# Altium project PO_Soldeerstation.PrjPcb
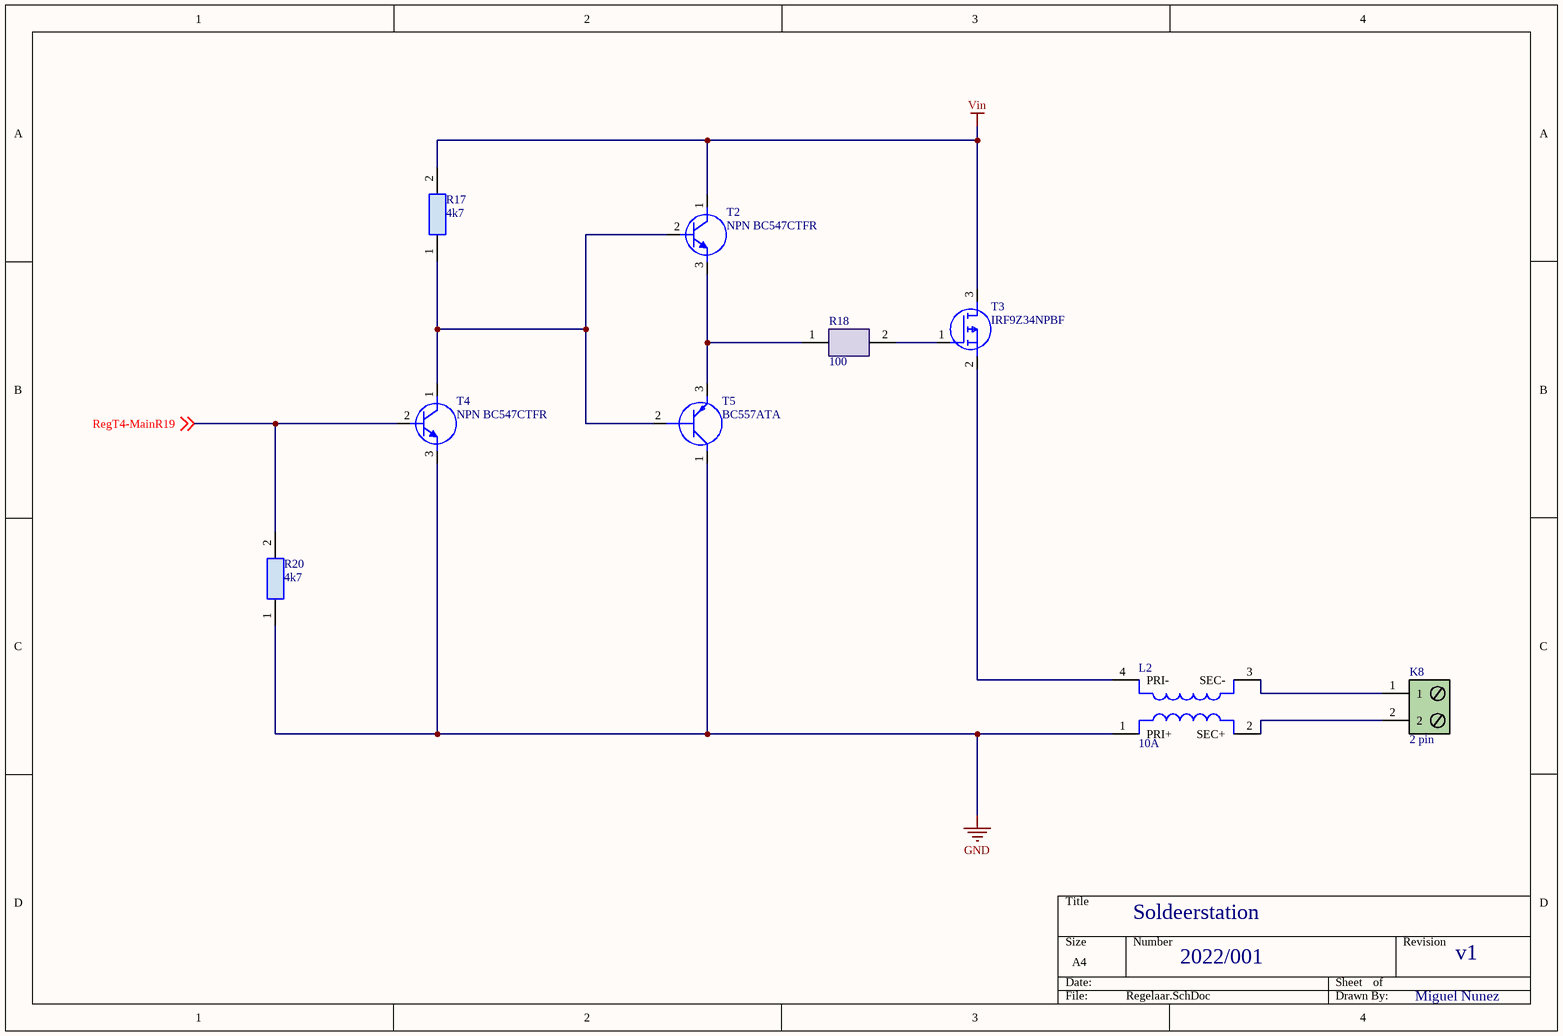
[diagram p0: Regelaar.SchDoc]
6 sheets, 87 parts. Net scope: global (net labels, ports and power ports of the same name join across sheets).
Board files: DisplayPrint.PcbDoc, NewPrintMainV3.PcbDoc, LedPrintV4.PcbDoc, MainSecEdition.PcbDoc, LedRond.PcbDoc
Sheets:
  Regelaar.SchDoc
  Display.SchDoc
  Versterker.SchDoc
  Voeding.SchDoc
  MainIC.SchDoc
  Led.SchDoc

## Sheet Regelaar.SchDoc: Soldeerstation
size A4; DrawnBy: Miguel Nunez; DocumentNumber: 2022/001; Revision: v1; SheetNumber: 1; SheetTotal: 6

### Parts
K8  2 pin  [1729128]
L2  10A  [CM2545X171B10]
R17  4k7  [CAPC2012X65N]
R18  100  [RESC1220X65N]
R20  4k7  [CAPC2012X65N]
T2  NPN BC547CTFR  [BC33740TA]
T3  IRF9Z34NPBF  [TO254P469X1042X1967-3P]
T4  NPN BC547CTFR  [BC33740TA]
T5  BC557ATA  [BC33740TA]

### Nets
GND: L2.1(PRI+) R20.1 T4.3(E) T5.1(C)
Vin: R17.2 T2.1(C) T3.3(D)
RegT4-MainR19: R20.2 T4.2(B) ; off-sheet RegT4-MainR19
NetK8_1: K8.1 L2.3(SEC-)
NetK8_2: K8.2 L2.2(SEC+)
NetL2_4: L2.4(PRI-) T3.2(S)
NetR17_1: R17.1 T2.2(B) T4.1(C) T5.2(B)
NetR18_1: R18.1 T2.3(E) T5.3(E)
NetR18_2: R18.2 T3.1(G)

### Library data of the parts
K8 = Term. blok 2 pin: Connector Term. blok. 1729128 2 pin; Manufacturer_Name: Phoenix Contact; Datasheet Link: http://www.phoenixcontact.com/de/produkte/1729128/pdf; Height: 10.15mm; Manufacturer_Part_Number: 1729128
L2 = CM2545X171B-10: common mode smoorspoel 10A; Manufacturer_Name: Laird Technologies; Datasheet Link: https://datasheet.datasheetarchive.com/originals/dk/DKDS-7/122753.pdf; Height: 9.5mm; Manufacturer_Part_Number: CM2545X171B-10
R17 R20 = RES 4k7 0805: 4k7 SMD 0805  ESR10EZPJ472; Manufacturer_Name: ROHM Semiconductor; Datasheet Link: https://componentsearchengine.com/Datasheets/2/ESR10EZPJ472.pdf; Height: 0.65mm; Manufacturer_Part_Number: ESR10EZPJ472
R18 = RES 100 0508: 100 Ohm SMD 0508  LTR10EZPJ101; Manufacturer_Name: ROHM Semiconductor; Datasheet Link: https://componentsearchengine.com//LTR10EZPJ101.pdf; Height: 0.65mm; Mouser2 Part Number: 755-LTR10EZPJ101; Mouser2 Price/Stock: https://www.mouser.com/Search/Refine.aspx?Keyword=755-LTR10EZPJ101; Manufacturer_Part_Number: LTR10EZPJ101
T2 T4 = TR BC547CTFR: Transistor BC547CTFR NPN; Mfr_Name: onsemi; Type: DEV; Copyright: Copyright (C) 2022 Ultra Librarian. All rights reserved.; Manufacturer_Part_Number: BC547CTFR; RefDes: RefDes
T3 = TR IRF9Z34NPBF: MOSFET (P-Channel); Manufacturer_Name: Infineon; Datasheet Link: https://componentsearchengine.com//IRF9Z34NPBF.pdf; Height: 4.69mm; Mouser2 Part Number: 942-IRF9Z34NPBF; Mouser2 Price/Stock: https://www.mouser.com/Search/Refine.aspx?Keyword=942-IRF9Z34NPBF; Manufacturer_Part_Number: IRF9Z34NPBF
T5 = TR BC557ATA: Transistor BJT BC557ATA PNP; Manufacturer_Name: ON Semiconductor; Datasheet Link: https://componentsearchengine.com//BC557ATA.pdf; Mouser2 Part Number: 512-BC557ATA; Mouser2 Price/Stock: https://www.mouser.com/Search/Refine.aspx?Keyword=512-BC557ATA; Manufacturer_Part_Number: BC557ATA

## Sheet Display.SchDoc: Soldeerstation
size A4; DrawnBy: Miguel Nunez; DocumentNumber: 2022/001; Revision: v1; SheetNumber: 2; SheetTotal: 6
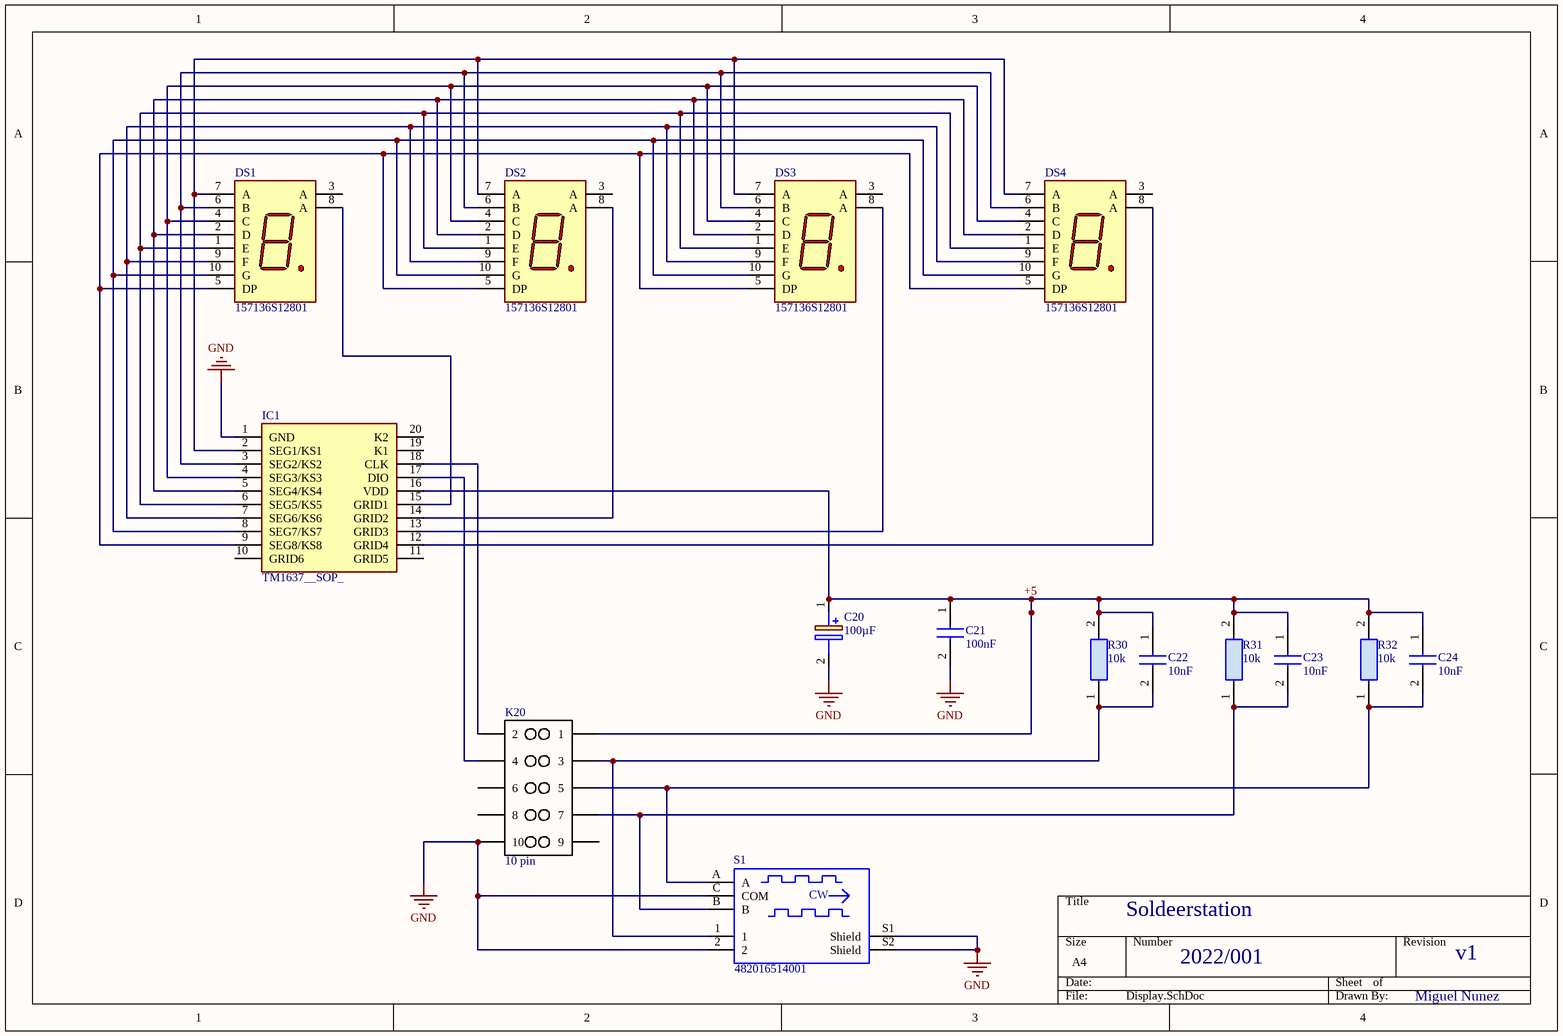
[diagram p1: Display.SchDoc]

### Parts
C20  100µF  [WCAP-AT1H_D10H16]
C21  100nF  [WCAP-CSGP_0805_L2W1.25H0.8_Reflow]
C22  10nF  [CAPC2012X100N]
C23  10nF  [CAPC2012X100N]
C24  10nF  [CAPC2012X100N]
DS1  157136S12801  [WL-T7DS_L17.5W12.4H7]
DS2  157136S12801  [WL-T7DS_L17.5W12.4H7]
DS3  157136S12801  [WL-T7DS_L17.5W12.4H7]
DS4  157136S12801  [WL-T7DS_L17.5W12.4H7]
IC1  TM1637__SOP_  [SOIC127P1045X280-20N]
K20  10 pin  [215307-5_TYC]
R30  10k  [RESC2012X60N]
R31  10k  [RESC2012X60N]
R32  10k  [RESC2012X60N]
S1  482016514001  [4820xx514001]

### Nets
+5: C20.1(+) C21.1 C22.1 C23.1 C24.1 IC1.16(VDD) K20.1 R30.2 R31.2 R32.2
GND: C20.2(-) C21.2 IC1.1(GND) K20.10 S1.2 S1.C(COM) S1.S1(Shield) S1.S2(Shield)
NetC22_2: C22.2 K20.3 R30.1 S1.1
NetC23_2: C23.2 K20.7 R31.1 S1.B
NetC24_2: C24.2 K20.5 R32.1 S1.A
NetDS1_1: DS1.1(E) DS2.1(E) DS3.1(E) DS4.1(E) IC1.6(SEG5/KS5)
NetDS1_2: DS1.2(D) DS2.2(D) DS3.2(D) DS4.2(D) IC1.5(SEG4/KS4)
NetDS1_4: DS1.4(C) DS2.4(C) DS3.4(C) DS4.4(C) IC1.4(SEG3/KS3)
NetDS1_5: DS1.5(DP) DS2.5(DP) DS3.5(DP) DS4.5(DP) IC1.9(SEG8/KS8)
NetDS1_6: DS1.6(B) DS2.6(B) DS3.6(B) DS4.6(B) IC1.3(SEG2/KS2)
NetDS1_7: DS1.7(A) DS2.7(A) DS3.7(A) DS4.7(A) IC1.2(SEG1/KS1)
NetDS1_8: DS1.8(A) IC1.15(GRID1)
NetDS1_9: DS1.9(F) DS2.9(F) DS3.9(F) DS4.9(F) IC1.7(SEG6/KS6)
NetDS1_10: DS1.10(G) DS2.10(G) DS3.10(G) DS4.10(G) IC1.8(SEG7/KS7)
NetDS2_8: DS2.8(A) IC1.14(GRID2)
NetDS3_8: DS3.8(A) IC1.13(GRID3)
NetDS4_8: DS4.8(A) IC1.12(GRID4)
NetIC1_17: IC1.17(DIO) K20.4
NetIC1_18: IC1.18(CLK) K20.2

Not connected (* = marked no-connect by the designer): DS1 3(A); DS2 3(A); DS3 3(A); DS4 3(A); IC1 10(GRID6) 11(GRID5) 19(K1) 20(K2); K20 6 8 9

### Notes on the sheet
- (in symbol 482016514001) CW

### Library data of the parts
C20 = ELCAP 100µF: Capacitor Polarised 100µF Wurth 860241181006; Manufacturer_Name: Wurth Elektronik; Datasheet Link: https://www.we-online.de/katalog/datasheet/860241181006.pdf; Height: 27mm; Manufacturer_Part_Number: 860241181006
C21 = CAP 0.1µF (100nF): Capacitor C0805C104K8RACAUTO; Manufacturer_Name: Kemet; Datasheet Link: https://ad.componentsearchengine.com/Datasheets/2/C0805C104K8RACAUTO.pdf; Height: 0.88mm; Manufacturer_Part_Number: C0805C104K8RACAUTO
C22-C24 = CAP 0.01µF (10nF): Capacitor C0805C103K1HACAUTO; Manufacturer_Name: Kemet; Datasheet Link: https://componentsearchengine.com//C0805C103K1HACAUTO.pdf; Height: 1mm; Mouser2 Part Number: 80-C0805C103K1HAUTO; Mouser2 Price/Stock: https://www.mouser.com/Search/Refine.aspx?Keyword=80-C0805C103K1HAUTO; Manufacturer_Part_Number: C0805C103K1HACAUTO
DS1-DS4 = 157136S12801: WL-T7DS 7 Segments Display THT Single Digit, Common Anode, 0.52" / 13.2mm, 38mcd, 2V, Super Red; Manufacturer: Wurth Elektronik; Circuitry: Common Anode; Width: 12.4mm; Mounting Technology: THT; Display Height: 0.52" / 13.2mm; Operating Temperature max.: 85C; Packaging: Tube; Luminous Intensity: 38mcd; Length: 17.5mm; ComponentLink2Description: Datasheet; Forward Voltage: 2V; ComponentLink1Description: Manufacturer Link; Manufacturer Part Number: 157136S12801; Height: 7mm; ComponentLink1URL: http://www.we-online.de; Emitting Color: Super Red; ComponentLink2URL: https://www.we-online.com/catalog/datasheet/157136S12801.pdf; Operating Temperature min.: -40C
IC1 = TM1637__SOP_: Integrated Circuit; Manufacturer_Name: TITAN MICRO ELECTRONICS; Manufacturer_Part_Number: TM1637 (SOP); Datasheet Link: https://www.mcielectronics.cl/website_MCI/static/documents/Datasheet_TM1637.pdf; Height: 2.8mm
K20 = Header 2x5: Header, 5-Pin, Dual row; LatestRevisionDate: 17-Jul-2002; LatestRevisionNote: Re-released for DXP Platform.; Publisher: Altium Limited
R30-R32 = RES 10k 0805: 10k SMD 0805  CR0805-FX-1002ELF; Manufacturer_Name: Bourns; Datasheet Link: https://componentsearchengine.com//CR0805-FX-1002ELF.pdf; Height: 0.6mm; Mouser2 Part Number: 652-CR0805FX-1002ELF; Mouser2 Price/Stock: https://www.mouser.com/Search/Refine.aspx?Keyword=652-CR0805FX-1002ELF; Manufacturer_Part_Number: CR0805-FX-1002ELF
S1 = 482016514001: WS-ENTV Mechanical Incremental Encoder Switch, Metal Shaft with bushing, 15Pulse/360deg, 30positions, 10mA; Manufacturer: Wurth Elektronik; Electrical Life Switch: 20000Cycles; Electrical Life Encoder: 15000Cycles; Insulation Resistance: 100MOhm; Operation Force: 600g; ComponentLink1Description: Manufacturer; ComponentLink1URL: http://www.we-online.de; ComponentLink2Description: Datasheet; ComponentLink2URL: https://www.we-online.com/catalog/datasheet/482016514001.pdf; Mounting Technology: THT; Manufacturer Part Number: 482016514001; Published Date: May 2021; Detent: 30positions; Operating Temperature: -40 to +85degC; Packaging: Tray; Resolution: 15Pulse/360deg; Rated Current: 10mA; Size: L13.75W11.7H26.6

## Sheet Versterker.SchDoc: Soldeerstation
size A4; DrawnBy: Miguel Nunez; DocumentNumber: 2022/001; Revision: v1; SheetNumber: 3; SheetTotal: 6
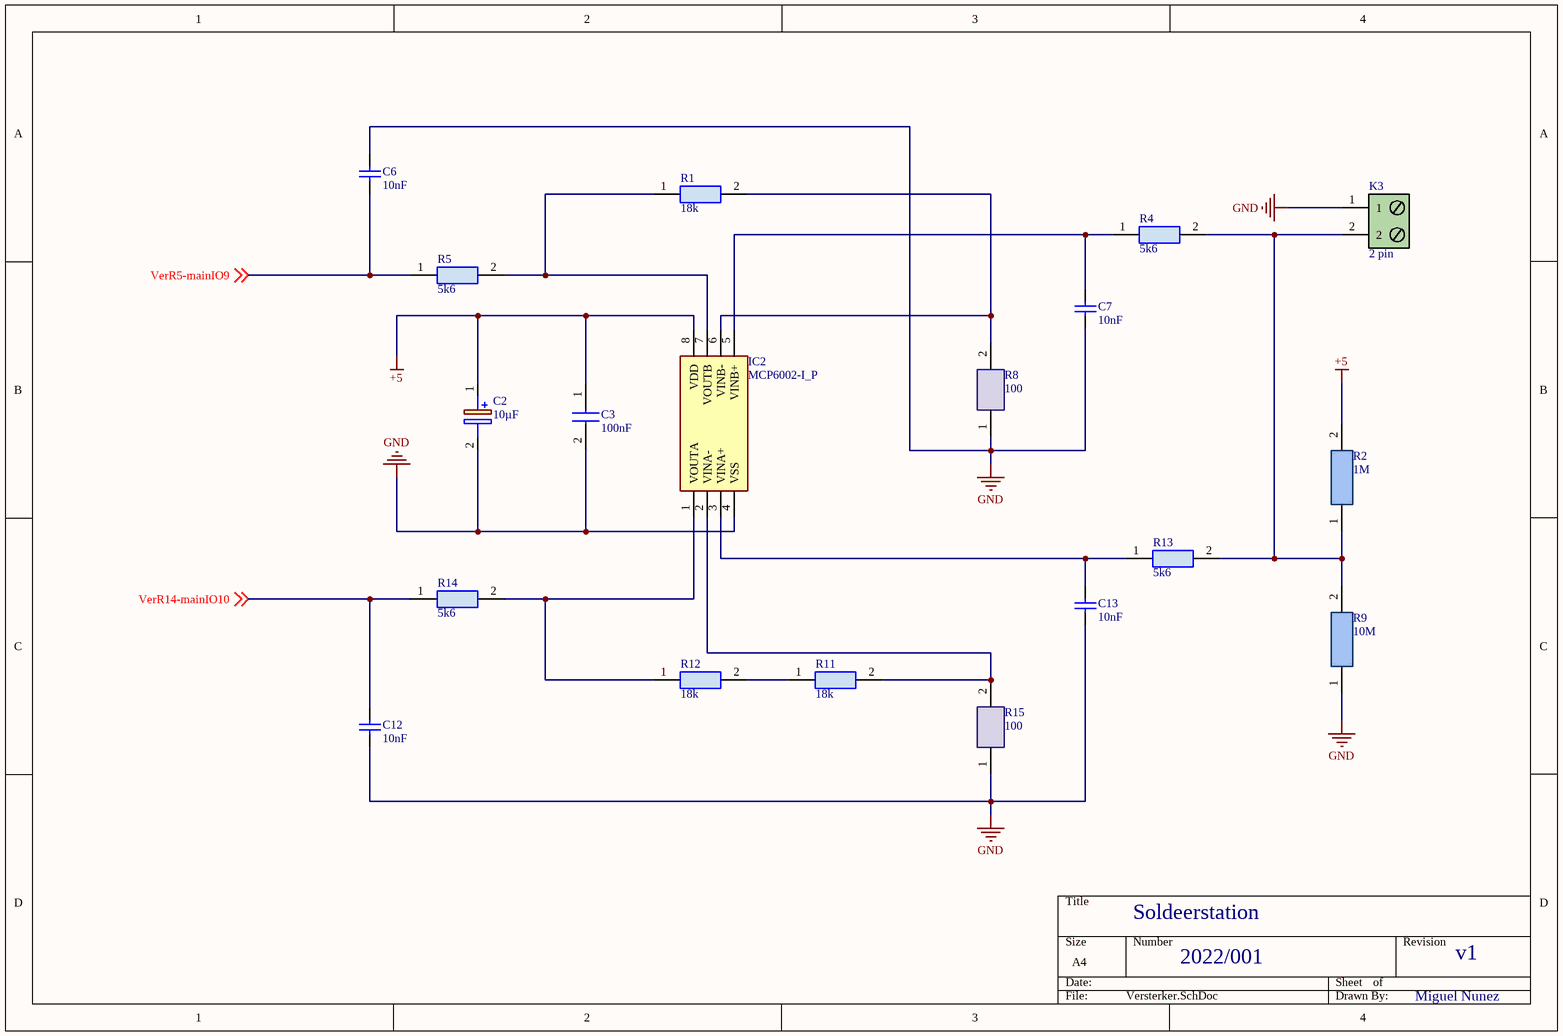
[diagram p2: Versterker.SchDoc]

### Parts
C2  10µF  [WCAP-AT1H_D5H11]
C3  100nF  [WCAP-CSGP_0805_L2W1.25H0.8_Reflow]
C6  10nF  [WCAP-CSGP_0805_L2W1.25H0.8_Reflow]
C7  10nF  [WCAP-CSGP_0805_L2W1.25H0.8_Reflow]
C12  10nF  [WCAP-CSGP_0805_L2W1.25H0.8_Reflow]
C13  10nF  [WCAP-CSGP_0805_L2W1.25H0.8_Reflow]
IC2  MCP6002-I_P  [DIP781W56P254L950H533Q8N]
K3  2 pin  [1729128]
R1  18k  [RESC2012X60N]
R2  1M  [RESC3115X65N]
R4  5k6  [RESC2012X50N]
R5  5k6  [RESC2012X50N]
R8  100  [RESC1220X65N]
R9  10M  [RESC3115X65N]
R11  18k  [RESC2012X60N]
R12  18k  [RESC2012X60N]
R13  5k6  [RESC2012X50N]
R14  5k6  [RESC2012X50N]
R15  100  [RESC1220X65N]

### Nets
+5: C2.1(+) C3.1 IC2.8(VDD) R2.2
GND: C2.2(-) C3.2 C6.2 C7.1 C12.1 C13.1 IC2.4(VSS) K3.1 R8.1 R9.1 R15.1
VerR5-mainIO9: C6.1 R5.1 ; off-sheet VerR5-mainIO9
VerR14-mainIO10: C12.2 R14.1 ; off-sheet VerR14-mainIO10
NetC7_2: C7.2 IC2.5(VINB+) R4.1
NetC13_2: C13.2 IC2.3(VINA+) R13.1
NetIC2_1: IC2.1(VOUTA) R12.1 R14.2
NetIC2_2: IC2.2(VINA-) R11.2 R15.2
NetIC2_6: IC2.6(VINB-) R1.2 R8.2
NetIC2_7: IC2.7(VOUTB) R1.1 R5.2
NetK3_2: K3.2 R2.1 R4.2 R9.2 R13.2
NetR11_1: R11.1 R12.2

### Library data of the parts
C2 = ELCAP 10µF: Capacitor Polarised Wurth Elektronik 860240672002 10µF; Datasheet Link: https://katalog.we-online.de/pbs/datasheet/860240672002.pdf; Height: 12.5mm; Manufacturer_Name: Wurth Elektronik; Manufacturer_Part_Number: 860240672002
C3 = CAP 0.1µF (100nF): as C21 on sheet Display; Datasheet Link: https://ad.componentsearchengine.com/Datasheets/2/C0805C104K8RACAUTO.pdf; Height: 0.88mm; Manufacturer_Part_Number: C0805C104K8RACAUTO
C6 C7 C12 C13 = CAP 0.01µF WE: WCAP-CSGP Multilayer Ceramic Chip Capacitor, General Purpose, size 0805, X7R, 10nF, 50V  885012207092; Manufacturer: Wurth Elektronik; Capacitance Tolerance: +/-10%; Dissipation Factor: 2.5%; Isolation Resistance: 10GOhm; Technical Reference: X7R0805103K050DFCT10000; Capacitance: 10nF; Ceramic Type: X7R; ComponentLink1Description: Manufacturer Link; ComponentLink1URL: http://www.we-online.de; ComponentLink2Description: Datasheet; ComponentLink2URL: https://www.we-online.com/catalog/datasheet/885012207092.pdf; Height: 0.8mm; Length: 2mm; Manufacturer Part Number: 885012207092; Mounting Technology: SMT; Operating Temperature max.: 125C; Operating Temperature min.: -55C; Packaging: Tape and Reel; Rated Voltage: 50V; Size: 0805; Width: 1.25mm
IC2 = MCP6002-I_P: Integrated Circuit Dual OPAMP MCP6002-I/P; Manufacturer_Name: Microchip; Datasheet Link: https://componentsearchengine.com//MCP6002-I_P.pdf; Height: 5.334mm; Mouser2 Part Number: 579-MCP6002-I/P; Mouser2 Price/Stock: https://www.mouser.com/Search/Refine.aspx?Keyword=579-MCP6002-I%2FP; Manufacturer_Part_Number: MCP6002-I/P
K3 = Term. blok 2 pin: as K8 on sheet Regelaar; Datasheet Link: http://www.phoenixcontact.com/de/produkte/1729128/pdf; Height: 10.15mm; Manufacturer_Part_Number: 1729128
R1 R11 R12 = RES 18k 0805: 18kΩ ±0.5% 0.1W 1/10W Chip Resistor 0805 (2012 Metric) Thin Film  RR1220P-183-D; Voltage Rating: 100V; Temperature Coefficient: 25ppm/°C; Power Rating: 100mW; Resistance: 18kR; Length: 2mm; Lead Free: Lead Free; Height: 0.4mm; Depth: 1.25mm; Packaging: Tape and Reel; Min Operating Temperature: -55°C; Case Code (Metric): 2012; Termination: SMD/SMT; Voltage Rating (DC): 100V; Case/Package: 0805; Max Operating Temperature: 125°C; RoHS Compliant: Yes; Mount: Surface Mount; Case Code (Imperial): 0805; Technology: THIN FILM; Tolerance: 0.5%; Number of Terminations: 2; Max Power Dissipation: 100mW; Series: RR; Size Code: 0805
R2 = RES 1M 1206: Res Thin Film 1206 1M0Ω 0.1% 0.25W 15ppm/°C Molded SMD; Manufacturer: TE Connectivity; Manufacturer Part Number: RP73D2B1M0BTDF; Voltage Rating: 200V; Temperature: -55°C to 155°C; Device Class L2: Resistors; Resistance: 1M0Ω; octopart_url: https://octopart.com/rp73d2b1m0btdf-te+connectivity-22741454; Power Rating: 0.25W; Temperature Range High: 155°C; ComponentLink2Description: Datasheet; Category: Res; Octopart: https://octopart.com/rp73d2b1m0btdf-te+connectivity-22741454; ComponentLink2URL: https://www.te.com/commerce/DocumentDelivery/DDEController?Action=showdoc&DocId=Data+Sheet%7F1773272%7FL%7Fpdf%7FEnglish%7FENG_DS_1773272_L.pdf%7F8-1879255-6; Package: RP732B; packaging: 1000 Reel; Ipc Land Pattern Name: RESC305155X55; Tolerance: 0.1%; Device Class L1: Passive Components; Series: RP73; Height: 0.65mm; Lead Free: Yes; Value: 1M0Ω; Device Class L3: Chip SMD Resistors; Temperature Coefficient: 15ppm/°C; Automotive: No; Composition: Thin Film; Temperature Range Low: -55°C; RoHS: TRUE
R4 R5 R13 R14 = RES 5k6 0805: 5k6 SMD 0805  CRCW08055K60JNEA; Manufacturer_Name: Vishay; Datasheet Link: http://www.vishay.com/docs/20035/dcrcwe3.pdf; Height: 0.5mm; Manufacturer_Part_Number: CRCW08055K60JNEA
R8 R15 = RES 100 0508: as R18 on sheet Regelaar; Datasheet Link: https://componentsearchengine.com//LTR10EZPJ101.pdf; Height: 0.65mm; Mouser2 Part Number: 755-LTR10EZPJ101; Mouser2 Price/Stock: https://www.mouser.com/Search/Refine.aspx?Keyword=755-LTR10EZPJ101; Manufacturer_Part_Number: LTR10EZPJ101
R9 = RES 10M 1206: Res Thin Film 1206 1M0Ω 0.1% 0.25W 15ppm/°C Molded SMD  1206 10M 5% 0.25W TCR200; Manufacturer: TE Connectivity; Manufacturer Part Number: RP73D2B1M0BTDF; Voltage Rating: 200V; Temperature: -55°C to 155°C; Device Class L2: Resistors; Resistance: 1M0Ω; octopart_url: https://octopart.com/rp73d2b1m0btdf-te+connectivity-22741454; Power Rating: 0.25W; Temperature Range High: 155°C; ComponentLink2Description: Datasheet; Category: Res; Octopart: https://octopart.com/rp73d2b1m0btdf-te+connectivity-22741454; ComponentLink2URL: https://www.te.com/commerce/DocumentDelivery/DDEController?Action=showdoc&DocId=Data+Sheet%7F1773272%7FL%7Fpdf%7FEnglish%7FENG_DS_1773272_L.pdf%7F8-1879255-6; Package: RP732B; packaging: 1000 Reel; Ipc Land Pattern Name: RESC305155X55; Tolerance: 0.1%; Device Class L1: Passive Components; Series: RP73; Height: 0.65mm; Lead Free: Yes; Value: 1M0Ω; Device Class L3: Chip SMD Resistors; Temperature Coefficient: 15ppm/°C; Automotive: No; Composition: Thin Film; Temperature Range Low: -55°C; RoHS: TRUE

## Sheet Voeding.SchDoc: Soldeerstation
size A4; DrawnBy: Miguel Nunez; DocumentNumber: 2022/001; Revision: v1; SheetNumber: 4; SheetTotal: 6
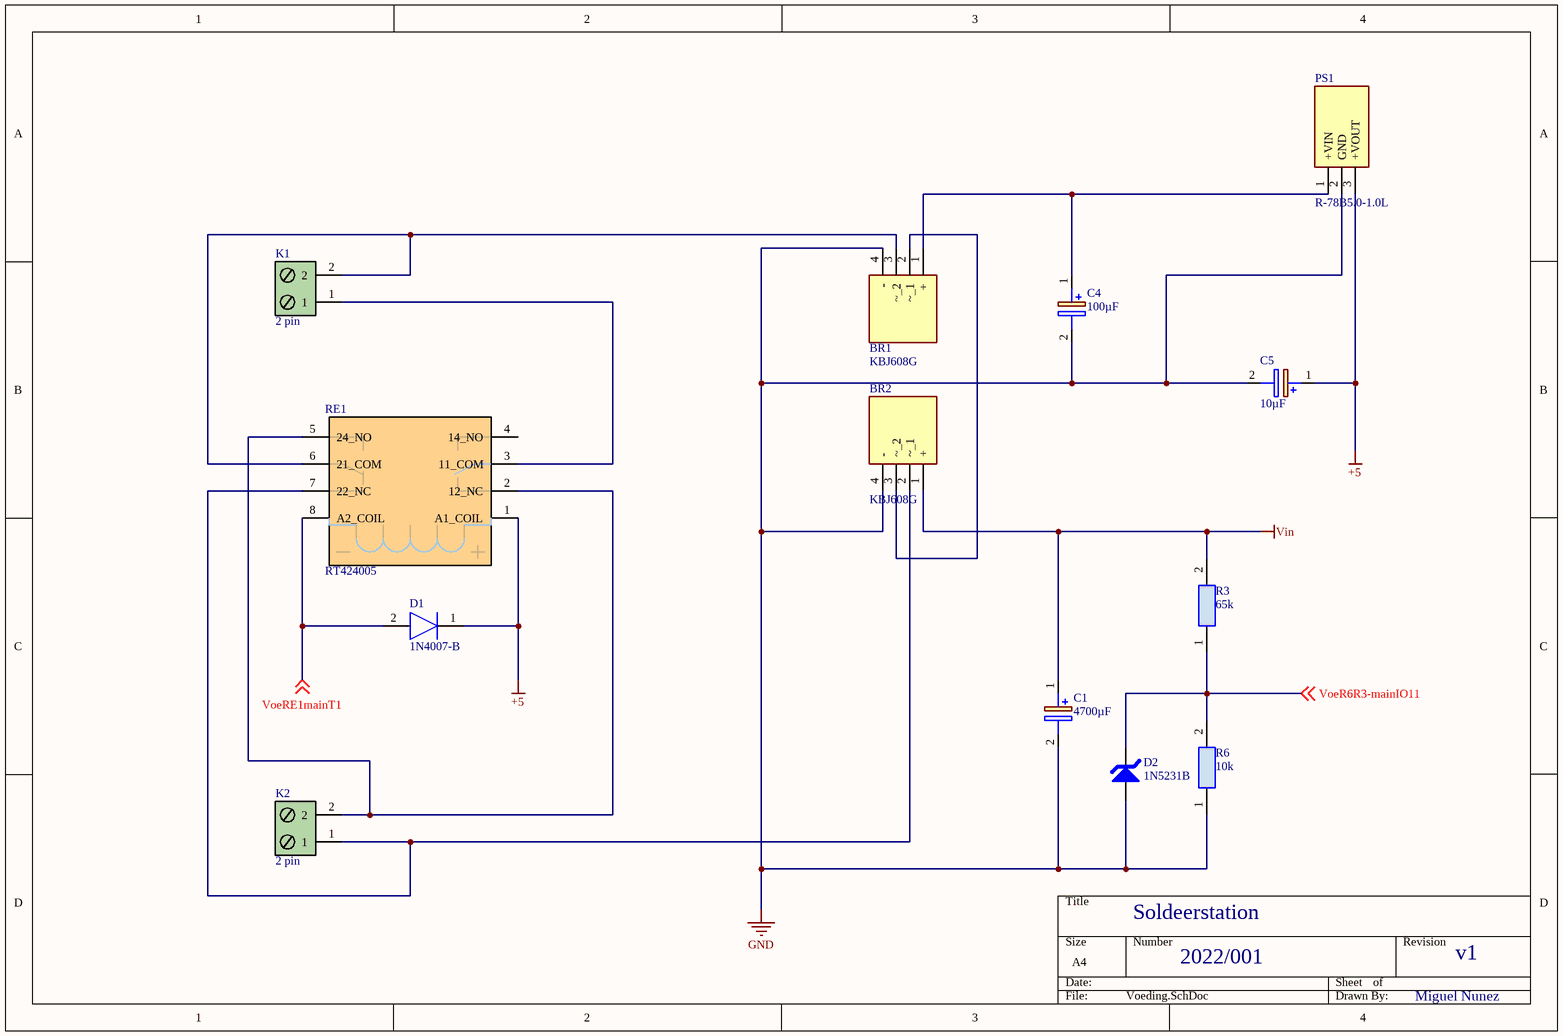
[diagram p3: Voeding.SchDoc]

### Parts
BR1  KBJ608G  [TO750P480X2500X1900-4P]
BR2  KBJ608G  [TO750P480X2500X1900-4P]
C1  4700µF  [WCAP-ATG8_D22H41]
C4  100µF  [WCAP-AT1H_D10H16]
C5  10µF  [WCAP-AT1H_D5H11]
D1  1N4007-B  [DIOAD1410W90L470D235]
D2  1N5231B  [DIOAD1165W56L425D185]
K1  2 pin  [1729128]
K2  2 pin  [1729128]
PS1  R-78B5.0-1.0L  [R78B1210L]
R3  65k  [RESC2012X60N]
R6  10k  [RESC2012X60N]
RE1  RT424005  [RT42]

### Nets
+5: C5.1(+) D1.1(K) PS1.3(+VOUT) RE1.1(A1_COIL)
GND: BR1.4(-) BR2.4(-) C1.2(-) C4.2(-) C5.2(-) D2.2 PS1.2(GND) R6.1
Vin: BR2.1(+) C1.1(+) R3.2
VoeR6R3-mainIO11: D2.1 R3.1 R6.2 ; off-sheet VoeR6R3-mainIO11
VoeRE1mainT1: D1.2(A) RE1.8(A2_COIL) ; off-sheet VoeRE1mainT1
NetBR1_1: BR1.1(+) C4.1(+) PS1.1(+VIN)
NetBR1_2: BR1.2(~_1) BR2.3(~_2)
NetBR1_3: BR1.3(~_2) K1.2 RE1.6(21_COM)
NetBR2_2: BR2.2(~_1) K2.1 RE1.7(22_NC)
NetK1_1: K1.1 RE1.3(11_COM)
NetK2_2: K2.2 RE1.2(12_NC) RE1.5(24_NO)

Not connected (* = marked no-connect by the designer): RE1 4(14_NO)

### Library data of the parts
BR1 BR2 = KBJ608G: Bridge Rectifier; Manufacturer_Name: Diodes Inc.; Datasheet Link: https://componentsearchengine.com//KBJ608G.pdf; Height: 4.8mm; Mouser2 Part Number: 621-KBJ608G; Mouser2 Price/Stock: https://www.mouser.com/Search/Refine.aspx?Keyword=621-KBJ608G; Manufacturer_Part_Number: KBJ608G
C1 = ELCAP 4700µF: Capacitor Polarised ESK478M050AQ3AA; Manufacturer_Name: Kemet; Datasheet Link: https://componentsearchengine.com//ESK478M050AQ3AA.pdf; Height: 37mm; Mouser2 Part Number: 80-ESK478M050AQ3AA; Mouser2 Price/Stock: https://www.mouser.com/Search/Refine.aspx?Keyword=80-ESK478M050AQ3AA; Manufacturer_Part_Number: ESK478M050AQ3AA
C4 = ELCAP 100µF: as C20 on sheet Display; Datasheet Link: https://www.we-online.de/katalog/datasheet/860241181006.pdf; Height: 27mm; Manufacturer_Part_Number: 860241181006
C5 = ELCAP 10µF: as C2 on sheet Versterker; Datasheet Link: https://katalog.we-online.de/pbs/datasheet/860240672002.pdf; Height: 12.5mm; Manufacturer_Name: Wurth Elektronik; Manufacturer_Part_Number: 860240672002
D1 = D 1N4007-B: Diode 1N4007-B 1000V, 1A; Manufacturer_Name: Rectron; Datasheet Link: https://www.arrow.com/en/products/1n4007-b/rectron; Manufacturer_Part_Number: 1N4007-B
D2 = ZD 1N5231B: Zenerdiode 1N5231B 5.1V 500mW; Mfr_Name: onsemi; Type: DEV; Copyright: Copyright (C) 2022 Ultra Librarian. All rights reserved.; Manufacturer_Part_Number: 1N5231B; RefDes: RefDes
K1 K2 = Term. blok 2 pin: as K8 on sheet Regelaar; Datasheet Link: http://www.phoenixcontact.com/de/produkte/1729128/pdf; Height: 10.15mm; Manufacturer_Part_Number: 1729128
PS1 = R-78B5.0-1.0L: Power Supply DC/DC converter 6.5-34Vin 5Vout; Manufacturer_Name: RECOM Power; Datasheet Link: https://componentsearchengine.com//R-78B5.0-1.0L.pdf; Height: 9mm; Mouser2 Part Number: 919-R-78B5.0-1.0L; Mouser2 Price/Stock: https://www.mouser.com/Search/Refine.aspx?Keyword=919-R-78B5.0-1.0L; Manufacturer_Part_Number: R-78B5.0-1.0L
R3 = RES 68k 0805: Res Thin Film 0805 68K Ohm 0.1% 1/8W ±25ppm/°C Molded SMD SMD Punched Carrier T/R; Manufacturer: Panasonic; Manufacturer Part Number: ERA-6AEB683V; Resistance: 68kR; Power Rating: 125mW; Voltage Rating: 100V; Supplier 1: RSComponents; RoHS: Yes; Category: Chip SMD Resistors; Stock 1: 790; Pricing 1: 5=0,49000, 50=0,45500, 100=0,42500, 250=0,39500, 500=0,36300 (USD); Mount: Surface Mount; Case/Package: 0805; Number of Pins: 2; Contact Plating: Tin; Case Code (Metric): 2012; Case Code (Imperial): 0805; Min Operating Temperature: -55°C; Max Operating Temperature: 155°C; Tolerance: 0.1%; Resistor Type: Thin Film; Temperature Coefficient: 25ppm/°C; Packaging: Tape and Reel; Package Quantity: 5000; Number of Terminations: 2; Termination: SMD/SMT; Max Power Dissipation: 125mW; Voltage Rating (DC): 100V; Series: ERA-6A; Resistance Tolerance: 0.1%; Technology: METAL FILM; Construction: Rectangular; Length: 2mm; Width: 1.25mm; Height: 0.5mm; Depth: 1.25mm; Radiation Hardening: No; REACH SVHC: No SVHC; Military Standard: Not; Lead Free: Lead Free; ComponentLink1URL: https://datasheet.ciiva.com/11812/0900766b80beefcc-11812834.pdf?src-supplier=RSComponents; ComponentLink1Description: https://datasheet.ciiva.com/11812/0900766b80beefcc-11812834.pdf?src-supplier=RSComponents; ComponentLink2URL: https://datasheet.ciiva.com/26335/453596-da-01-en-widerstand-0805-era-26335721.pdf?src-supplier=Conrad; ComponentLink2Description: https://datasheet.ciiva.com/26335/453596-da-01-en-widerstand-0805-era-26335721.pdf?src-supplier=Conrad; ComponentLink3URL: https://datasheet.ciiva.com/7886/485442-7886653.pdf?src-supplier=Element14; ComponentLink3Description: https://datasheet.ciiva.com/7886/485442-7886653.pdf?src-supplier=Element14; ComponentLink4URL: https://datasheet.ciiva.com/48530/era-eng-tds-48530013.pdf?src-supplier=Distrelec; ComponentLink4Description: https://datasheet.ciiva.com/48530/era-eng-tds-48530013.pdf?src-supplier=Distrelec; ComponentLink5URL: https://datasheet.ciiva.com/48425/era-eng-tds-48425626.pdf?src-supplier=Distrelec; ComponentLink5Description: https://datasheet.ciiva.com/48425/era-eng-tds-48425626.pdf?src-supplier=Distrelec; ComponentLink6URL: https://datasheet.ciiva.com/6138/485442-6138605.pdf?src-supplier=Farnell; ComponentLink6Description: https://datasheet.ciiva.com/6138/485442-6138605.pdf?src-supplier=Farnell; ComponentLink7URL: https://datasheet.ciiva.com/7886/485442-7886654.pdf?src-supplier=Element14; ComponentLink7Description: https://datasheet.ciiva.com/7886/485442-7886654.pdf?src-supplier=Element14; ComponentLink8URL: https://datasheet.ciiva.com/9188/aoa0000ce26-9188075.pdf?src-supplier=Avnet; ComponentLink8Description: https://datasheet.ciiva.com/9188/aoa0000ce26-9188075.pdf?src-supplier=Avnet; ComponentLink9URL: https://datasheet.ciiva.com/30076/54aoa0000ce26-30076872.pdf?src-supplier=Onlinecomponents.com; ComponentLink9Description: https://datasheet.ciiva.com/30076/54aoa0000ce26-30076872.pdf?src-supplier=Onlinecomponents.com; ComponentLink10URL: https://datasheet.ciiva.com/17208/aoa0000ce26-17208888.pdf?src-supplier=Avnet+Europe; ComponentLink10Description: https://datasheet.ciiva.com/17208/aoa0000ce26-17208888.pdf?src-supplier=Avnet+Europe
R6 = RES 10k 0805: as R30 on sheet Display; Datasheet Link: https://componentsearchengine.com//CR0805-FX-1002ELF.pdf; Height: 0.6mm; Mouser2 Part Number: 652-CR0805FX-1002ELF; Mouser2 Price/Stock: https://www.mouser.com/Search/Refine.aspx?Keyword=652-CR0805FX-1002ELF; Manufacturer_Part_Number: CR0805-FX-1002ELF
RE1 = RT424005: Relay or Contactor; Manufacturer_Name: TE Connectivity; Datasheet Link: https://componentsearchengine.com//RT424005.pdf; Mouser2 Part Number: 655-RT424005; Mouser2 Price/Stock: https://www.mouser.com/Search/Refine.aspx?Keyword=655-RT424005; Manufacturer_Part_Number: RT424005

## Sheet MainIC.SchDoc: Soldeerstation
size A4; DrawnBy: Miguel Nunez; DocumentNumber: 2022/001; Revision: v1; SheetNumber: 5; SheetTotal: 6
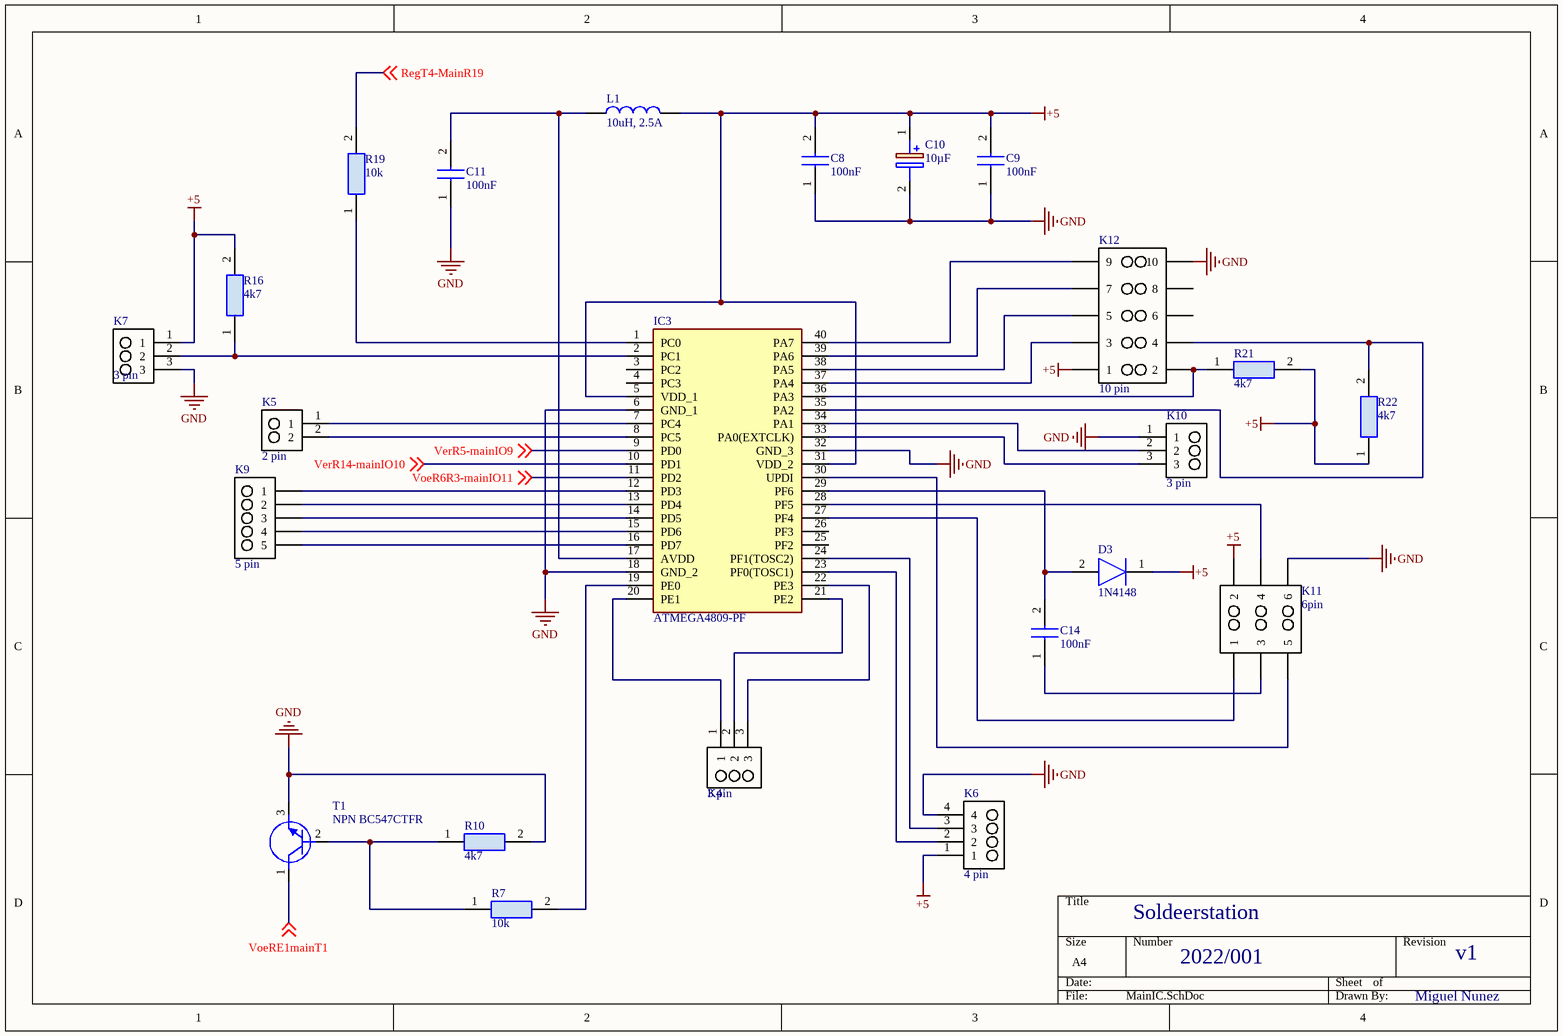
[diagram p4: MainIC.SchDoc]

### Parts
C8  100nF  [WCAP-CSGP_0805_L2W1.25H0.8_Reflow]
C9  100nF  [WCAP-CSGP_0805_L2W1.25H0.8_Reflow]
C10  10µF  [WCAP-AT1H_D5H11]
C11  100nF  [WCAP-CSGP_0805_L2W1.25H0.8_Reflow]
C14  100nF  [WCAP-CSGP_0805_L2W1.25H0.8_Reflow]
D3  1N4148  [DIOAD1165W56L425D185]
IC3  ATMEGA4809-PF  [DIP1543W58P254L5175H635Q40N]
K4  3 pin  [691214310003]
K5  2 pin  [691214110002]
K6  4 pin  [SHDR4W78P0X254_1X4_1026X252X700P]
K7  3 pin  [691214310003]
K9  5 pin  [215297-5_TYC]
K10  3 pin  [691214310003]
K11  6pin  [215307-3_TYC]
K12  10 pin  [215307-5_TYC]
L1  10uH, 2.5A  [744711003]
R7  10k  [RESC2012X60N]
R10  4k7  [CAPC2012X65N]
R16  4k7  [CAPC2012X65N]
R19  10k  [RESC2012X60N]
R21  4k7  [CAPC2012X65N]
R22  4k7  [CAPC2012X65N]
T1  NPN BC547CTFR  [BC33740TA]

### Nets
+5: C8.2 C9.2 C10.1(+) D3.1(K) IC3.5(VDD_1) IC3.31(VDD_2) K6.1 K7.1 K11.2 K12.1 L1.2 R16.2 R21.2 R22.1
GND: C8.1 C9.1 C10.2(-) C11.1 IC3.6(GND_1) IC3.18(GND_2) IC3.32(GND_3) K6.4 K7.3 K10.1 K11.6 K12.10 R10.2 T1.3(E)
RegT4-MainR19: R19.2 ; off-sheet RegT4-MainR19
VerR5-mainIO9: IC3.9(PD0) ; off-sheet VerR5-mainIO9
VerR14-mainIO10: IC3.10(PD1) ; off-sheet VerR14-mainIO10
VoeR6R3-mainIO11: IC3.11(PD2) ; off-sheet VoeR6R3-mainIO11
VoeRE1mainT1: T1.1(C) ; off-sheet VoeRE1mainT1
NetC11_2: C11.2 IC3.17(AVDD) L1.1
NetC14_1: C14.1 K11.3
NetC14_2: C14.2 D3.2(A) IC3.29(PF6)
NetIC3_1: IC3.1(PC0) R19.1
NetIC3_2: IC3.2(PC1) K7.2 R16.1
NetIC3_7: IC3.7(PC4) K5.1
NetIC3_8: IC3.8(PC5) K5.2
NetIC3_12: IC3.12(PD3) K9.1
NetIC3_13: IC3.13(PD4) K9.2
NetIC3_14: IC3.14(PD5) K9.3
NetIC3_15: IC3.15(PD6) K9.4
NetIC3_16: IC3.16(PD7) K9.5
NetIC3_19: IC3.19(PE0) R7.2
NetIC3_20: IC3.20(PE1) K4.1
NetIC3_21: IC3.21(PE2) K4.2
NetIC3_22: IC3.22(PE3) K4.3
NetIC3_23: IC3.23(PF0(TOSC1)) K6.2
NetIC3_24: IC3.24(PF1(TOSC2)) K6.3
NetIC3_27: IC3.27(PF4) K11.1
NetIC3_28: IC3.28(PF5) K11.4
NetIC3_30: IC3.30(UPDI) K11.5
NetIC3_33: IC3.33(PA0(EXTCLK)) K10.3
NetIC3_34: IC3.34(PA1) K10.2
NetIC3_35: IC3.35(PA2) K12.4 R22.2
NetIC3_36: IC3.36(PA3) K12.2 R21.1
NetIC3_37: IC3.37(PA4) K12.3
NetIC3_38: IC3.38(PA5) K12.5
NetIC3_39: IC3.39(PA6) K12.7
NetIC3_40: IC3.40(PA7) K12.9
NetR7_1: R7.1 R10.1 T1.2(B)

Not connected (* = marked no-connect by the designer): IC3 3(PC2) 4(PC3) 25(PF2) 26(PF3); K12 6 8

### Library data of the parts
C8 C9 C11 C14 = CAP 0.1µF (100nF): as C21 on sheet Display; Datasheet Link: https://ad.componentsearchengine.com/Datasheets/2/C0805C104K8RACAUTO.pdf; Height: 0.88mm; Manufacturer_Part_Number: C0805C104K8RACAUTO
C10 = ELCAP 10µF: as C2 on sheet Versterker; Datasheet Link: https://katalog.we-online.de/pbs/datasheet/860240672002.pdf; Height: 12.5mm; Manufacturer_Name: Wurth Elektronik; Manufacturer_Part_Number: 860240672002
D3 = D 1N4148: Diode 1N4148 100V, 200mA; Manufacturer_Name: Nexperia; Datasheet Link: https://datasheet.datasheetarchive.com/originals/distributors/Datasheets-112/DSAP0040891.pdf; Manufacturer_Part_Number: 1N4148
IC3 = ATMEGA4809-PF: Integrated Circuit; Manufacturer_Name: Microchip; Datasheet Link: https://componentsearchengine.com//ATMEGA4809-PF.pdf; Height: 6.35mm; Mouser2 Part Number: 556-ATMEGA4809-PF; Mouser2 Price/Stock: https://www.mouser.com/Search/Refine.aspx?Keyword=556-ATMEGA4809-PF; Manufacturer_Part_Number: ATMEGA4809-PF
K4 K7 K10 = Header 1x3pin: Connector 61900311121 3 pin; Manufacturer_Name: Wurth Elektronik; Datasheet Link: https://katalog.we-online.de/em/datasheet/61900311121.pdf; Height: 11.75mm; Manufacturer_Part_Number: 61900311121
K5 = Header 1x2pin: Connector 2 pin 212520-1002; Manufacturer_Name: Molex; Datasheet Link: https://www.molex.com/pdm_docs/sd/2125201002_sd.pdf; Height: 13.6mm; Manufacturer_Part_Number: 212520-1002
K6 = Header 1x4pin: Connector 216571-3004 1x4 pin; Manufacturer_Name: Molex; Datasheet Link: https://www.molex.com/pdm_docs/sd/2165711002_sd.pdf; Height: 9.91mm; Manufacturer_Part_Number: 216571-3004
K9 = Header 1x 5pin: Header, 5-Pin; LatestRevisionDate: 17-Jul-2002; LatestRevisionNote: Re-released for DXP Platform.; Publisher: Altium Limited
K11 = Header 2x3: Header, 3-Pin, Dual row; LatestRevisionDate: 17-Jul-2002; LatestRevisionNote: Re-released for DXP Platform.; Publisher: Altium Limited
K12 = Header 2x5: Header, 5-Pin, Dual row; LatestRevisionDate: 17-Jul-2002; LatestRevisionNote: Re-released for DXP Platform.; Publisher: Altium Limited
L1 = spoel WE klein: WE-SD THT Rod Core Choke, 10uH, 2.5A  744711003; Manufacturer: Wurth Elektronik; DC Resistance: 33mOhm; ComponentLink1Description: Manufacturer; ComponentLink1URL: http://www.we-online.de; ComponentLink2Description: Datasheet; ComponentLink2URL: https://www.we-online.com/catalog/datasheet/744711003.pdf; Operating Temperature: -40 to +150degC; Packaging: Carton; Published Date: May 2021; Inductance: 10uH; Manufacturer Part Number: 744711003; Mounting Technology: THT; Rated Current: 2.5A
R7 R19 = RES 10k 0805: as R30 on sheet Display; Datasheet Link: https://componentsearchengine.com//CR0805-FX-1002ELF.pdf; Height: 0.6mm; Mouser2 Part Number: 652-CR0805FX-1002ELF; Mouser2 Price/Stock: https://www.mouser.com/Search/Refine.aspx?Keyword=652-CR0805FX-1002ELF; Manufacturer_Part_Number: CR0805-FX-1002ELF
R10 R16 R21 R22 = RES 4k7 0805: as R17 on sheet Regelaar; Datasheet Link: https://componentsearchengine.com/Datasheets/2/ESR10EZPJ472.pdf; Height: 0.65mm; Manufacturer_Part_Number: ESR10EZPJ472
T1 = TR BC547CTFR: as T2 on sheet Regelaar; Copyright: Copyright (C) 2022 Ultra Librarian. All rights reserved.; Manufacturer_Part_Number: BC547CTFR; RefDes: RefDes

## Sheet Led.SchDoc
size A4; SheetNumber: 6; SheetTotal: 6
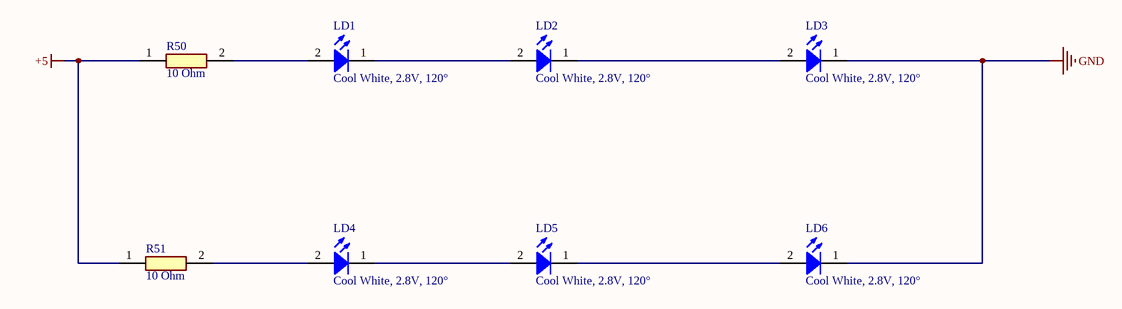
[diagram p5: Led.SchDoc]

### Parts
LD1  Cool White, 2.8V, 120°  [WL-SWTP_5630_L5.6W3H0.6]
LD2  Cool White, 2.8V, 120°  [WL-SWTP_5630_L5.6W3H0.6]
LD3  Cool White, 2.8V, 120°  [WL-SWTP_5630_L5.6W3H0.6]
LD4  Cool White, 2.8V, 120°  [WL-SWTP_5630_L5.6W3H0.6]
LD5  Cool White, 2.8V, 120°  [WL-SWTP_5630_L5.6W3H0.6]
LD6  Cool White, 2.8V, 120°  [WL-SWTP_5630_L5.6W3H0.6]
R50  10 Ohm  [Weerstand LEDS]
R51  10 Ohm  [Weerstand LEDS]

### Nets
+5: R50.1 R51.1
GND: LD3.1(K) LD6.1(K)
NetLD1_1: LD1.1(K) LD2.2(A)
NetLD1_2: LD1.2(A) R50.2
NetLD2_1: LD2.1(K) LD3.2(A)
NetLD4_1: LD4.1(K) LD5.2(A)
NetLD4_2: LD4.2(A) R51.2
NetLD5_1: LD5.1(K) LD6.2(A)

### Library data of the parts
LD1-LD6 = 158563260A: WL-SWTP SMT White Top view PLCC, size 5630, Cool White, 2.8V, 120°; Manufacturer: Wurth Elektronik; Color Rendering Index: 85; Correlated Color Temperature: 6000K; Luminous Flux: 35lm; Chip Technology: InGaN; Viewing Angle: 120°; ComponentLink1URL: http://www.we-online.de; Size: 5630; Emitting Color: Cool White; Forward Voltage: 2.8V; ComponentLink2URL: https://www.we-online.com/catalog/datasheet/158563260A.pdf; ComponentLink1Description: Manufacturer Link; ComponentLink2Description: Datasheet; Manufacturer Part Number: 158563260A; Operating Temperature max.: 85C; Mounting Technology: SMT; Packaging: Tape and Reel; Height: 0.6mm; Length: 5.6mm; Operating Temperature min.: -40C; Width: 3mm
R50 R51 = EP5WS10RJ: Resistor LED; Manufacturer_Name: TE Connectivity; Datasheet Link: https://www.te.com/commerce/DocumentDelivery/DDEController?Action=showdoc&DocId=Data+Sheet%7F9-1773463-6%7FA%7Fpdf%7FEnglish%7FENG_DS_9-1773463-6_A.pdf%7F2176083-1; Manufacturer_Part_Number: EP5WS10RJ

## Nets that join several sheets
+5: Display (10 pins), Versterker (C2.1 C3.1 IC2.8 R2.2), Voeding (C5.1 D1.1 PS1.3 RE1.1), MainIC (14 pins), Led (R50.1 R51.1)
GND: Regelaar (L2.1 R20.1 T4.3 T5.1), Display (8 pins), Versterker (11 pins), Voeding (8 pins), MainIC (14 pins), Led (LD3.1 LD6.1)
Vin: Regelaar (R17.2 T2.1 T3.3), Voeding (BR2.1 C1.1 R3.2)
RegT4-MainR19: Regelaar (R20.2 T4.2), MainIC (R19.2)
VerR5-mainIO9: Versterker (C6.1 R5.1), MainIC (IC3.9)
VerR14-mainIO10: Versterker (C12.2 R14.1), MainIC (IC3.10)
VoeR6R3-mainIO11: Voeding (D2.1 R3.1 R6.2), MainIC (IC3.11)
VoeRE1mainT1: Voeding (D1.2 RE1.8), MainIC (T1.1)